# EAGLE design dc-motor-driver (EAGLE 4.16)
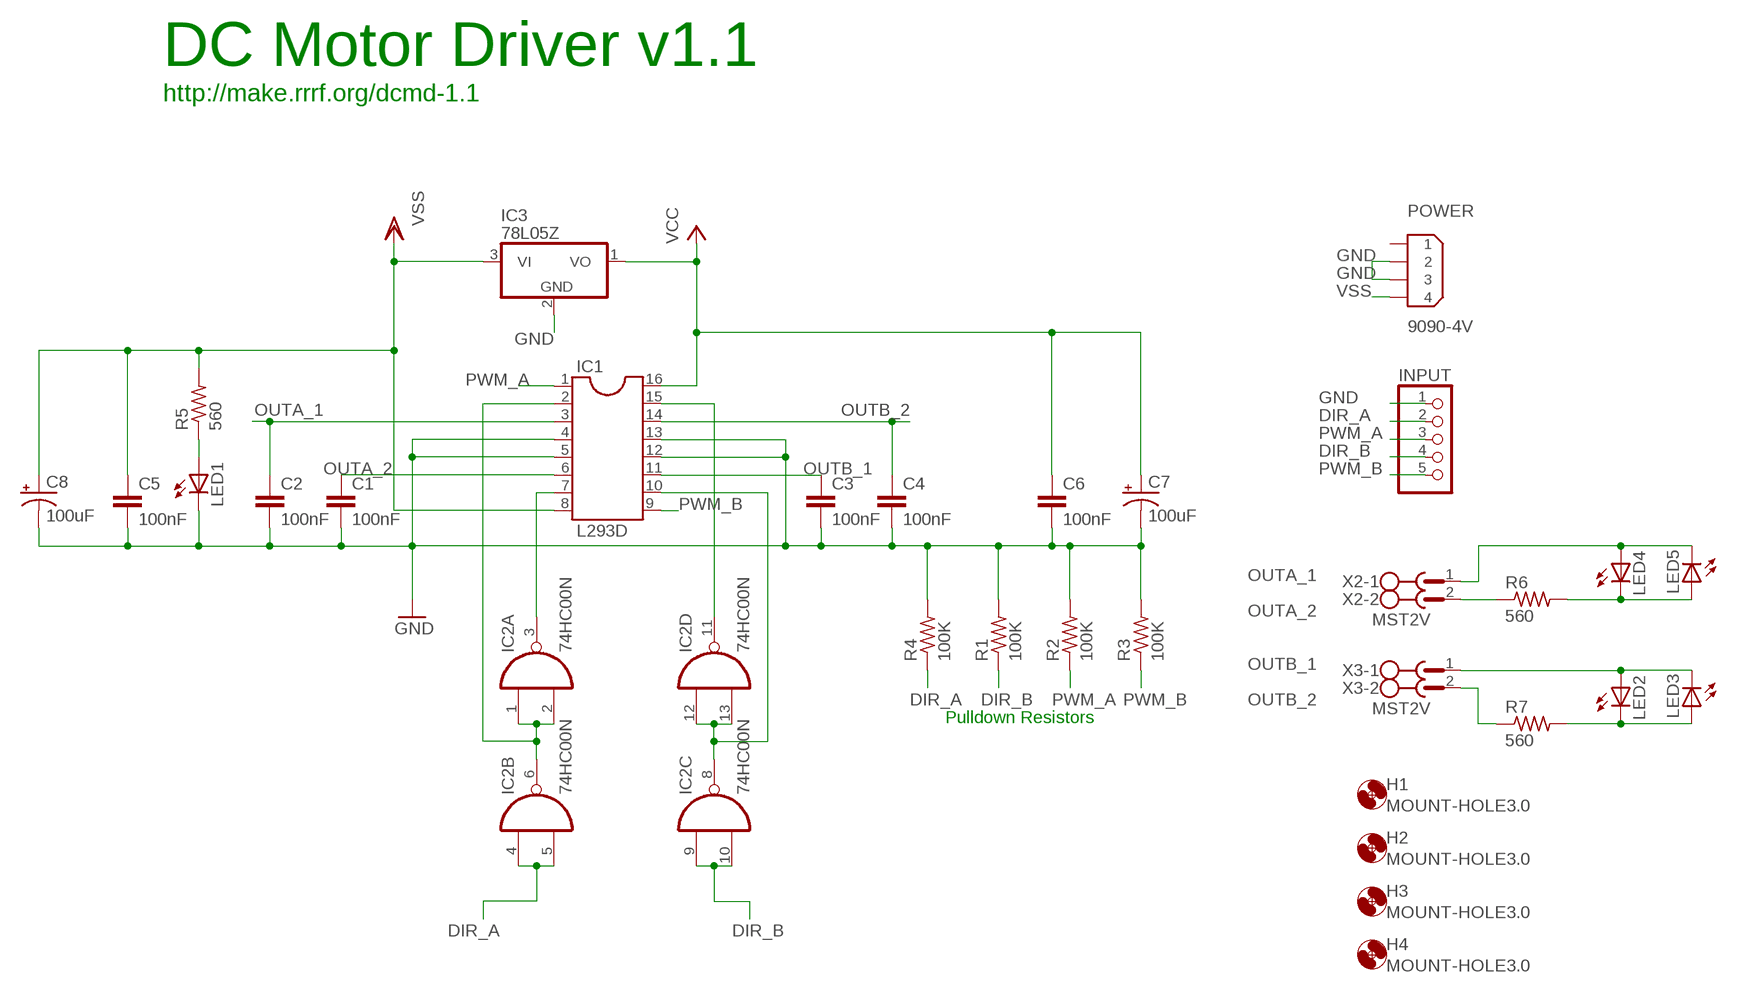
[diagram p0: schematic, sheet 1]

## Parts
C1  100nF  C-EU050-035X075  [C050-035X075]
C2  100nF  C-EU050-035X075  [C050-035X075]
C3  100nF  C-EU050-035X075  [C050-035X075]
C4  100nF  C-EU050-035X075  [C050-035X075]
C5  100nF  C-EU050-035X075  [C050-035X075]
C6  100nF  C-EU050-035X075  [C050-035X075]
C7  100uF  CPOL-USE3.5-8  [E3,5-8]
C8  100uF  CPOL-USE3.5-8  [E3,5-8]
H1  MOUNT-HOLE3.0  [3,0]
H2  MOUNT-HOLE3.0  [3,0]
H3  MOUNT-HOLE3.0  [3,0]
H4  MOUNT-HOLE3.0  [3,0]
IC1  L293D  DIL16S  [SOCKED-16]
IC2  74HC00N  [DIL14]
IC3  78L05Z  [TO92]
INPUT  PINHD-1X5  [1X05]
LED1  LED5MM  [LED5MM]
LED2  LED5MM  [LED5MM]
LED3  LED5MM  [LED5MM]
LED4  LED5MM  [LED5MM]
LED5  LED5MM  [LED5MM]
POWER  9090-4V  [9090-4V]
R1  100K  R-US_0207/7  [0207/7]
R2  100K  R-US_0207/7  [0207/7]
R3  100K  R-US_0207/7  [0207/7]
R4  100K  R-US_0207/7  [0207/7]
R5  560  R-US_0207/7  [0207/7]
R6  560  R-US_0207/7  [0207/7]
R7  560  R-US_0207/7  [0207/7]
X2  MST2V  [MSTBV2]
X3  MST2V  [MSTBV2]

## Nets
DIR_A: IC2.4(B:I0) IC2.5(B:I1) INPUT.2 R4.1
DIR_B: IC2.9(C:I0) IC2.10(C:I1) INPUT.4 R1.1
GND: C1.2 C2.2 C3.2 C4.2 C5.2 C6.2 C7.- C8.- IC1.4 IC1.5 IC1.12 IC1.13 IC3.2(GND) INPUT.1 LED1.K(C) POWER.2 POWER.3 R1.2 R2.2 R3.2 R4.2
N$1: IC1.7 IC2.3(A:O)
N$2: IC1.2 IC2.1(A:I0) IC2.2(A:I1) IC2.6(B:O)
N$3: IC1.15 IC2.11(D:O)
N$4: IC1.10 IC2.8(C:O) IC2.12(D:I0) IC2.13(D:I1)
N$5: LED1.A R5.1
N$6: LED2.K(C) LED3.A R7.2
N$8: LED4.K(C) LED5.A R6.2
OUTA_1 [power]: C2.1 IC1.3 LED4.A LED5.K(C) X2.1
OUTA_2 [power]: C1.1 IC1.6 R6.1 X2.2
OUTB_1 [power]: C3.1 IC1.11 LED2.A LED3.K(C) X3.1
OUTB_2 [power]: C4.1 IC1.14 R7.1 X3.2
PWM_A: IC1.1 INPUT.3 R2.1
PWM_B: IC1.9 INPUT.5 R3.1
VCC: C6.1 C7.+ IC1.16 IC3.1(VO)
VSS [power]: C5.1 C8.+ IC1.8 IC3.3(VI) POWER.4 R5.2
Unconnected: POWER.1

## Notes on the sheet
- DC Motor Driver v1.1
- http://make.rrrf.org/dcmd-1.1
- Pulldown Resistors

## Power pins joined to a net without a drawn wire
GND: IC2.7(P:GND)
VCC: IC2.14(P:VCC)

## Library data of the parts
C1-C6 = rcl:C-EU: CAPACITOR, European symbol
C7 C8 = rcl:CPOL-US: POLARIZED CAPACITOR, American symbol
H1-H4 = holes:MOUNT-HOLE: MOUNTING HOLE with drill center marker
IC1 = ic-package:DIL16: Dual In Line
IC2 = 74xx-eu:74*00: Quad 2-input NAND gate
IC3 = linear:78*: Positive VOLTAGE REGULATOR Source: http://cache.national.com/ds/LM/LM78L05.pdf http://www.fairchildsemi.com/ds/LM/LM7805.pdf
INPUT = pinhead:PINHD-1X5: PIN HEADER
LED1-LED5 = led:LED: LED OSRAM: - CHIPLED LG R971, LG N971, LY N971, LG Q971, LY Q971, LO R971, LY R971 LH N974, LH R974 LS Q976, LO Q976, LY Q976 LO Q996 - Hyper CHIPLED LW Q18S LB Q993, LB Q99A, LB R99A - SideLED LS A670, LO A670, LY A670, LG A670, LP A670 LB A673, LV A673, LT A673, LW A673 LH A674 LY A675 LS A676, LA A676, LO A676, LY A676, LW A676 LS A679, LY A679, LG A679 - Hyper Micro SIDELED® LS Y876, LA Y876, LO Y876, LY Y876 LT Y87S - SmartLED LW L88C, LW L88S LB L89C, LB L89S, LG L890 LS L89K, LO L89K, LY L89K LS L896, LA L896, LO L896, LY L896 - TOPLED LS T670, LO T670, LY T670, LG T670, LP T670 LSG T670, LSP T670, LSY T670, LOP T670, LYG T670 LG T671, LOG T671, LSG T671 LB T673, LV T673, LT T673, LW T673 LH T674 LS T676, LA T676, LO T676, LY T676, LB T676, LH T676, LSB T676, LW T676 LB T67C, LV T67C, LT T67C, LS T67K, LO T67K, LY T67K, LW E67C LS E67B, LA E67B, LO E67B, LY E67B, LB E67C, LV E67C, LT E67C LW T67C LS T679, LY T679, LG T679 LS T770, LO T770, LY T770, LG T770, LP T770 LB T773, LV T773, LT T773, LW T773 LH T774 LS E675, LA E675, LY E675, LS T675 LS T776, LA T776, LO T776, LY T776, LB T776 LHGB T686 LT T68C, LB T68C - Hyper Mini TOPLED® LB M676 - Mini TOPLED Santana® LG M470 LS M47K, LO M47K, LY M47K Source: http://www.osram.convergy.de - LUMILED® LXK2-PW12-R00, LXK2-PW12-S00, LXK2-PW14-U00, LXK2-PW14-V00 LXK2-PM12-R00, LXK2-PM12-S00, LXK2-PM14-U00 LXK2-PE12-Q00, LXK2-PE12-R00, LXK2-PE12-S00, LXK2-PE14-T00, LXK2-PE14-U00 LXK2-PB12-K00, LXK2-PB12-L00, LXK2-PB12-M00, LXK2-PB14-N00, LXK2-PB14-P00, LXK2-PB14-Q00 LXK2-PR12-L00, LXK2-PR12-M00, LXK2-PR14-Q00, LXK2-PR14-R00 LXK2-PD12-Q00, LXK2-PD12-R00, LXK2-PD12-S00 LXK2-PH12-R00, LXK2-PH12-S00 LXK2-PL12-P00, LXK2-PL12-Q00, LXK2-PL12-R00 Source: www.luxeon.com
POWER = con-thomas-betts:9090-4: Disk Drive Power four position Source: Thomas & Betts Electronic Interconnects Eiropean Edition 1998
R1-R7 = rcl:R-US_: RESISTOR, American symbol
X2 X3 = con-phoenix-508:MST2V: PHOENIX

## Net classes
0 default: width 0.406 mm, drill 0.635 mm
1 power: width 0.508 mm, drill 0.635 mm

## Board
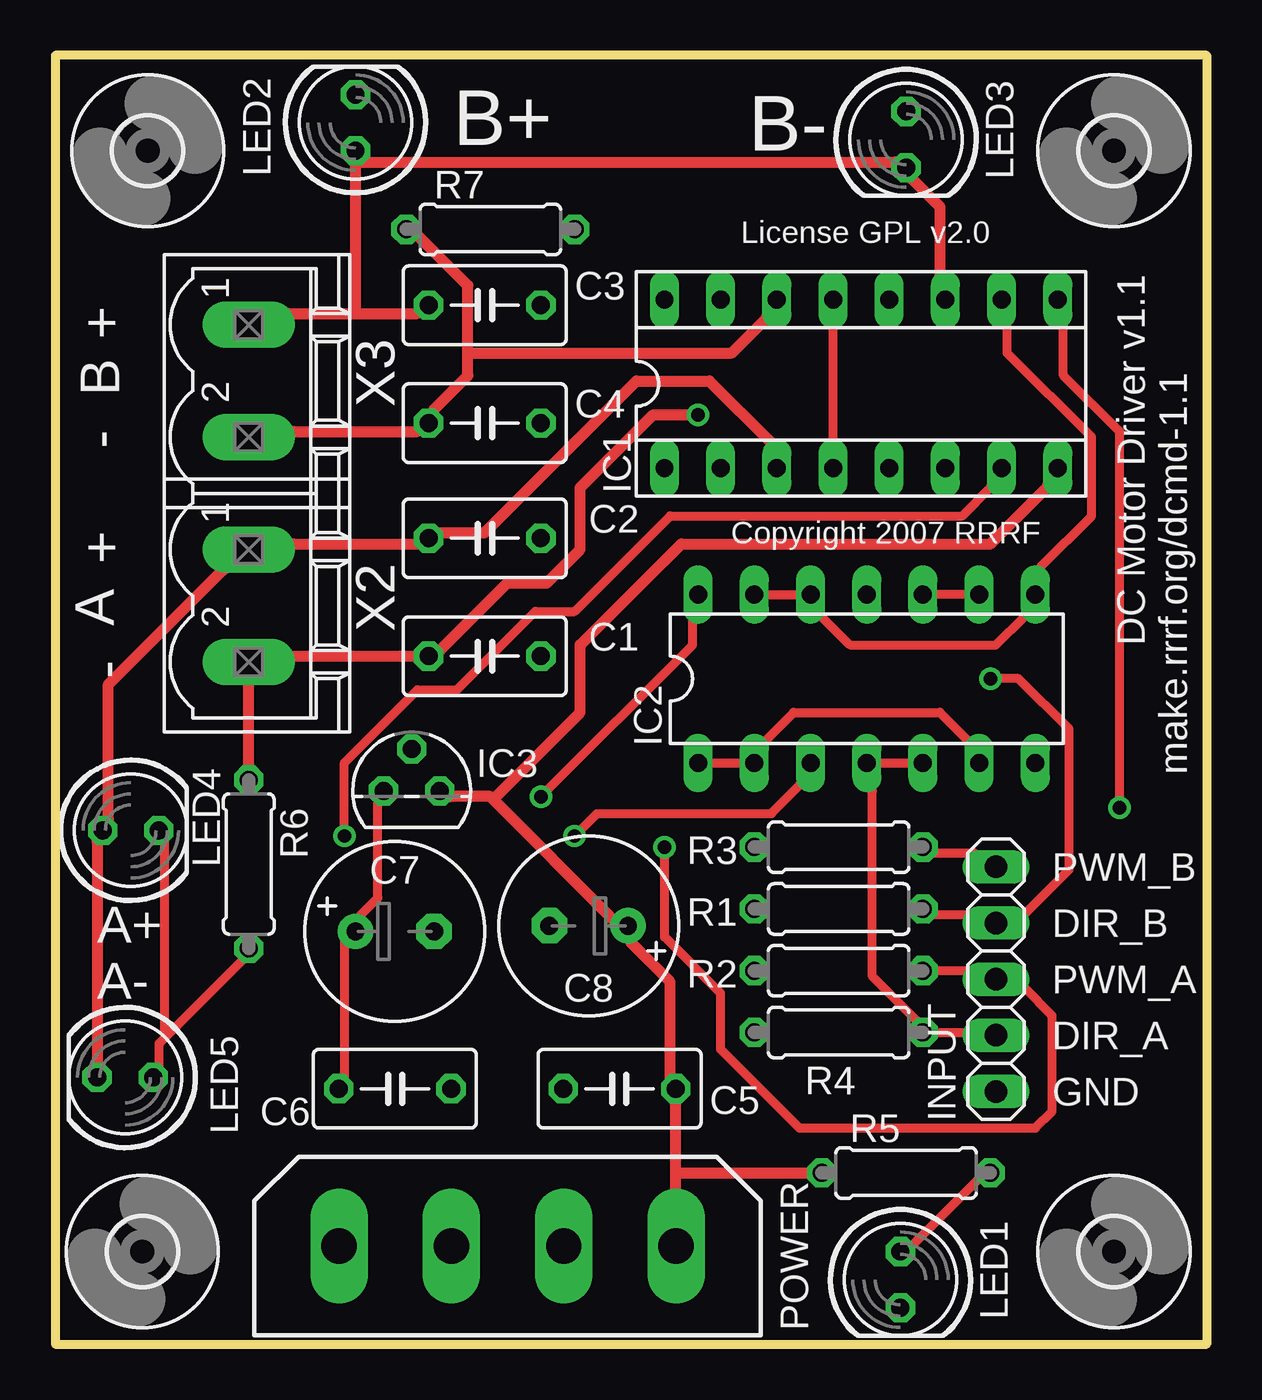
[diagram p1: board, top side]
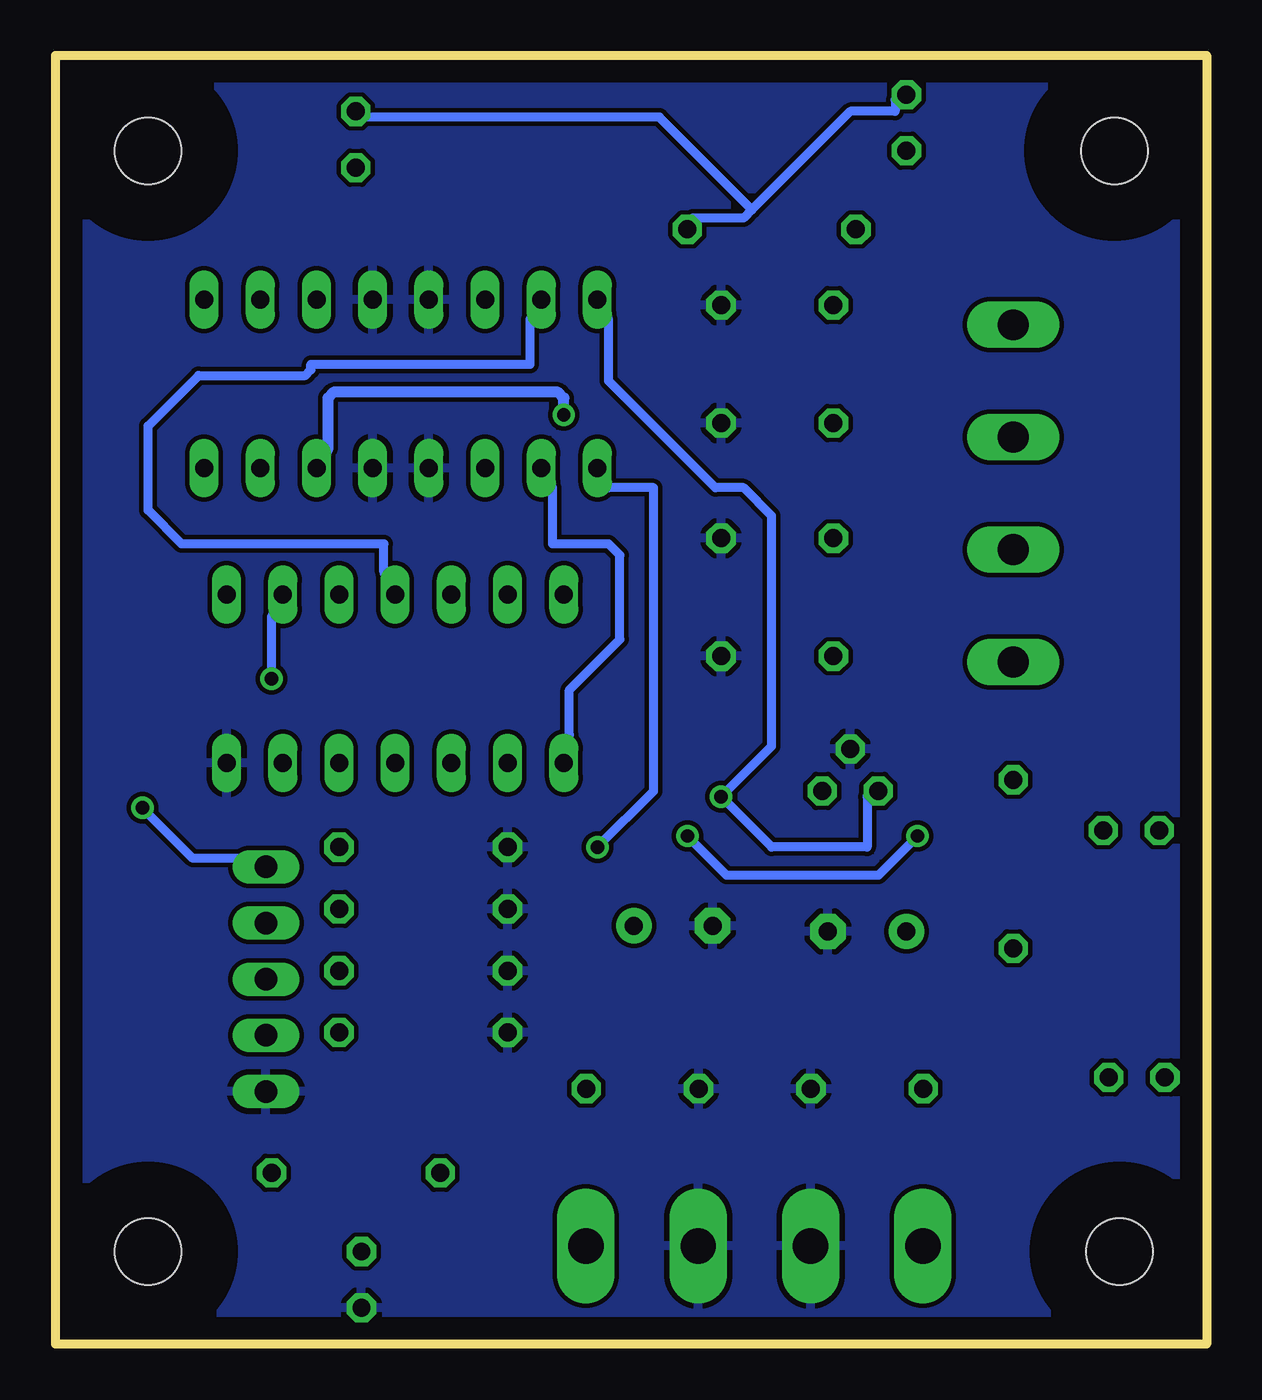
[diagram p2: board, bottom side, seen from below]

Size 52.05 x 58.29 mm. Coordinates in mm from the lower left corner, seen from the top.
Outline: 52.05,58.29 0,58.29 0,0 52.05,0 52.05,58.29
Copper layers (1*16): Top 0.035mm / dielectric 1.5mm / Bottom 0.035mm
Design rules "default": minimum track width 10mil, minimum drill 24mil, track to track 8mil, track to pad 8mil, pad to pad 8mil, via to via 8mil, smd to smd 8mil, copper to edge 40mil, drill to drill 8mil, minimum pad ring 10mil, minimum via ring 8mil, stop-mask expansion 4mil, vias tented up to drill 0mil, thermal gap 10mil

### Footprints (pad centres in the part's own frame; a part is rotated, then mirrored left to right if it is on the bottom)
C050-035X075 = drill 0.813 octagon: 1 -2.54,0; 2 2.54,0
E3,5-8 = drill 0.813 pad 1.6 round: + -1.778,0 | drill 0.813 pad 1.6 octagon: - 1.778,0
3,0 = hole 3: 0,0
SOCKED-16 = drill 0.813 long: 1 -8.89,-3.81; 2 -6.35,-3.81; 3 -3.81,-3.81; 4 -1.27,-3.81; 5 1.27,-3.81; 6 3.81,-3.81; 7 6.35,-3.81; 8 8.89,-3.81; 9 8.89,3.81; 10 6.35,3.81; 11 3.81,3.81; 12 1.27,3.81; 13 -1.27,3.81; 14 -3.81,3.81; 15 -6.35,3.81; 16 -8.89,3.81
DIL14 = drill 0.813 long: 1 -7.62,-3.81; 2 -5.08,-3.81; 3 -2.54,-3.81; 4 0,-3.81; 5 2.54,-3.81; 6 5.08,-3.81; 7 7.62,-3.81; 8 7.62,3.81; 9 5.08,3.81; 10 2.54,3.81; 11 0,3.81; 12 -2.54,3.81; 13 -5.08,3.81; 14 -7.62,3.81
TO92 = drill 0.813 octagon: 1 -1.27,0; 2 0,1.905; 3 1.27,0
1X05 = drill 1.016 long: 1 -5.08,0; 2 -2.54,0; 3 0,0; 4 2.54,0; 5 5.08,0
LED5MM = drill 0.813 octagon: A -1.27,0; K 1.27,0
9090-4V = drill 1.6 pad 2.6 long: 1 -7.62,0; 2 -2.54,0; 3 2.54,0; 4 7.62,0
0207/7 = drill 0.813 octagon: 1 -3.81,0; 2 3.81,0
MSTBV2 = drill 1.397 long: 1 -2.54,0; 2 2.54,0

### Placement (x,y rotation side)
C1  19.41,31.11 0 top
C2  19.41,36.45 0 top
C3  19.41,46.99 0 top
C4  19.41,41.66 0 top
C5  25.51,11.56 180 top
C6  15.35,11.56 0 top
C7  15.35,18.67 0 top
C8  24.11,18.92 180 top
H1  3.94,4.19 0 top
H2  47.86,4.19 0 top
H3  47.86,53.98 0 top
H4  4.17,53.98 0 top
IC1  36.43,43.43 0 top
IC2  36.69,30.1 0 top
IC3  16.11,25.02 0 top
INPUT  42.53,16.51 90 top
LED1  38.21,2.92 270 top
LED2  13.57,55.24 90 top
LED3  38.46,54.48 270 top
LED4  3.41,23.24 0 top
LED5  3.16,12.06 180 top
POWER  20.45,4.45 0 top
R1  35.42,19.68 180 top
R2  35.42,16.89 180 top
R3  35.42,22.48 180 top
R4  35.42,14.1 180 top
R5  38.46,7.75 180 top
R6  8.75,21.72 270 top
R7  19.67,50.42 0 top
X2  8.75,33.4 270 top
X3  8.75,43.56 270 top

### Tracks (layer width: path | path; a pad name or v marks a point on that pad's centre or on a via)
DIR_A
  Top 0.406: IC2.5 IC2.4 36.94,25.02 36.94,16.64 38.97,14.6 R4.1 41.26,14.1 INPUT.2
DIR_B  (via drill 0.61)
  Top 0.406: IC2.9 IC2.10 | R1.1 39.73,19.43 41.26,19.43 INPUT.4 43.8,19.43 45.83,21.46 45.83,27.81 43.54,30.1 v42.27,30.1
  Bottom 0.406: v42.27,30.1 42.27,32.89 IC2.9
GND
  Top 0.406: 35.16,39.5 IC1.4 IC1.13
  pour Bottom: -0.65,59.05 52.94,59.05 52.94,-0.89 -0.65,-0.89
N$1  (via drill 0.61)
  Top 0.406: v23.48,22.99 24.49,24 32.37,24 33.64,25.27 IC2.3 | v13.06,22.99 13.06,26.29 16.37,29.59 18.14,29.59 21.7,33.15 23.48,33.15 27.8,37.47 41,37.47 42.27,38.73 IC1.7
  Bottom 0.406: v23.48,22.99 21.7,21.21 14.84,21.21 v13.06,22.99
N$2
  Top 0.406: IC2.1 IC2.2 32.11,27.3 33.38,28.57 39.99,28.57 41.26,27.3 IC2.6
  Bottom 0.406: IC1.2 29.57,38.73 29.57,36.2 27.03,36.2 26.53,35.69 26.53,31.88 28.81,29.59 28.81,27.56 IC2.1
N$3
  Bottom 0.406: IC2.11 37.19,34.92 37.19,36.2 46.34,36.2 47.86,37.72 47.86,41.53 45.58,43.81 40.75,43.81 40.5,44.07 40.5,44.32 30.59,44.32 30.59,46.35 IC1.15
N$4
  Top 0.406: IC2.13 IC2.12 34.65,32.89 35.92,31.62 42.53,31.62 43.8,32.89 IC2.8 44.56,35.18 46.85,37.47 46.85,41.02 43.04,44.83 43.04,46.1 IC1.10
N$5
  Top 0.406: LED1.A 38.72,4.45 41.77,7.49 R5.1
N$6
  Bottom 0.406: 20.56,51.31 20.94,50.93 23.22,50.93 R7.2 | 20.56,51.31 16.11,55.75 14.08,55.75 14.08,56.26 LED2.K | LED3.A 37.96,55.5 24.75,55.5 20.56,51.31
N$8
  Top 0.406: 5.06,13.97 8.49,17.4 R6.2 | 5.06,13.97 4.68,13.59 4.68,12.57 LED5.A | LED4.K 4.94,22.73 4.94,14.1 5.06,13.97
OUTA_1
  Top 0.508: LED5.K 1.89,22.73 LED4.A 2.4,23.75 2.4,29.84 7.48,34.92 X2.1 10.78,36.2 16.37,36.2 C2.1 17.38,36.7 19.41,36.7 26.27,43.56 29.57,43.56 32.37,40.77 IC1.3
OUTA_2  (via drill 0.61)
  Top 0.508: R6.1 X2.2 10.78,31.11 C1.1 17.38,31.37 20.43,34.42 22.21,34.42 23.73,35.94 23.73,38.73 27.03,42.04 v29.07,42.04
  Bottom 0.508: v29.07,42.04 29.07,42.8 29.32,43.05 39.48,43.05 39.73,42.8 39.73,40.51 IC1.6
OUTB_1
  Top 0.508: IC1.11 39.99,48.39 39.99,51.44 38.72,52.7 LED3.K 37.96,53.47 13.83,53.47 LED2.A 13.57,46.61 | 13.57,46.61 10.52,46.61 X3.1 | 13.57,46.61 16.37,46.61 C3.1
OUTB_2
  Top 0.508: X3.2 10.78,41.27 16.37,41.27 C4.1 17.13,42.29 18.65,43.81 18.65,44.83 | 18.65,44.83 18.65,47.88 16.37,50.16 R7.1 | 18.65,44.83 30.59,44.83 32.11,46.35 IC1.14
PWM_A  (via drill 0.61)
  Top 0.406: R2.1 41.26,16.89 INPUT.3 43.8,16.13 45.07,14.86 45.07,10.54 44.31,9.78 33.64,9.78 30.08,13.34 30.08,15.88 27.54,18.41 v27.54,22.48
  Bottom 0.406: v27.54,22.48 25,25.02 25,38.73 27.03,38.73 IC1.1
PWM_B  (via drill 0.61)
  Top 0.406: R3.1 39.73,22.22 41.51,22.22 INPUT.5 | v48.12,24.26 48.12,41.27 45.58,43.81 45.58,46.1 IC1.9
  Bottom 0.406: v48.12,24.26 45.83,21.97 43.8,21.97 INPUT.5
VCC  (via drill 0.61)
  Top 0.406: C6.1 13.06,12.06 13.06,18.16 C7.+ 13.83,19.43 14.59,20.19 14.59,24.51 IC3.1 | v21.95,24.77 28.81,31.62 28.81,32.64 IC2.14
  Bottom 0.406: IC3.1 15.35,24.77 15.35,22.48 19.67,22.48 v21.95,24.77 19.67,27.05 19.67,37.47 20.94,38.73 22.21,38.73 27.03,43.56 27.03,46.35 IC1.16
VSS
  Top 0.508: 28.05,7.75 28.05,6.98 POWER.4 | 28.05,7.75 C5.1 27.8,12.06 27.8,16.38 26.02,18.16 C8.+ 25.26,19.18 19.8,24.64 | 28.05,7.75 R5.2 | 19.8,24.64 19.67,24.77 17.89,24.77 IC3.3 | IC1.8 44.81,38.73 42.27,36.2 28.3,36.2 23.73,31.62 23.73,28.57 19.8,24.64

### Text on the board
tPlace: B+ | B- | License GPL v2.0 | DC Motor Driver v1.1 | + | B | - | Copyright 2007 RRRF | + | A | - | make.rrrf.org/dcmd-1.1 | PWM_B | A+ | DIR_B | PWM_A | A- | DIR_A | GND